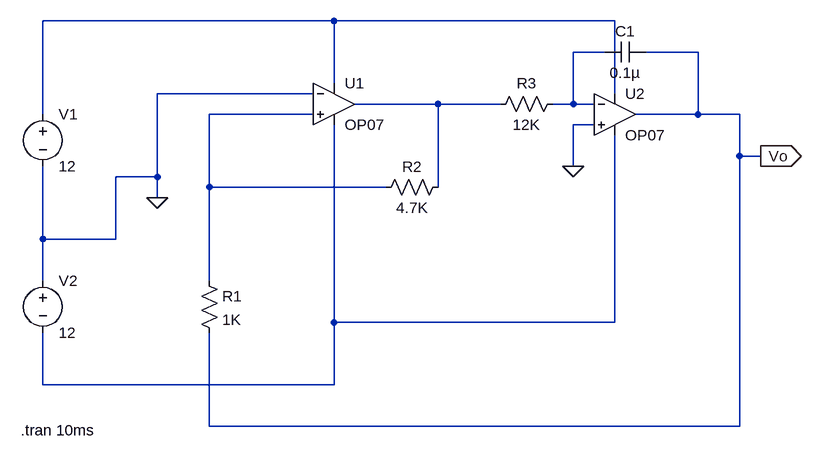
[diagram p0: schematic EC3.asc]
EC3.asc, the LTspice schematic file:
Version 4
SHEET 1 1192 744
WIRE 448 96 0 96
WIRE 880 96 448 96
WIRE 864 144 816 144
WIRE 1008 144 928 144
WIRE 448 192 448 96
WIRE 416 208 176 208
WIRE 880 208 880 96
WIRE 608 224 480 224
WIRE 704 224 608 224
WIRE 816 224 816 144
WIRE 816 224 784 224
WIRE 848 224 816 224
WIRE 0 240 0 96
WIRE 416 240 256 240
WIRE 1008 240 1008 144
WIRE 1008 240 912 240
WIRE 1072 240 1008 240
WIRE 848 256 816 256
WIRE 1072 304 1072 240
WIRE 1104 304 1072 304
WIRE 816 320 816 256
WIRE 176 336 176 208
WIRE 176 336 112 336
WIRE 256 352 256 240
WIRE 528 352 256 352
WIRE 608 352 608 224
WIRE 176 368 176 336
WIRE 0 432 0 320
WIRE 112 432 112 336
WIRE 112 432 0 432
WIRE 0 496 0 432
WIRE 256 496 256 352
WIRE 448 560 448 256
WIRE 880 560 880 272
WIRE 880 560 448 560
WIRE 0 656 0 576
WIRE 448 656 448 560
WIRE 448 656 0 656
WIRE 256 720 256 576
WIRE 1072 720 1072 304
WIRE 1072 720 256 720
FLAG 176 368 0
FLAG 816 320 0
FLAG 1104 304 Vo
IOPIN 1104 304 Out
SYMBOL voltage 0 224 R0
WINDOW 123 0 0 Left 0
WINDOW 39 0 0 Left 0
SYMATTR InstName V1
SYMATTR Value 12
SYMBOL voltage 0 480 R0
WINDOW 123 0 0 Left 0
WINDOW 39 0 0 Left 0
SYMATTR InstName V2
SYMATTR Value 12
SYMBOL OpAmps\\OP07 448 160 R0
SYMATTR InstName U1
SYMBOL res 624 336 R90
WINDOW 0 0 56 VBottom 2
WINDOW 3 32 56 VTop 2
SYMATTR InstName R2
SYMATTR Value 4.7K
SYMATTR SpiceLine tol=1 pwr=0.1
SYMBOL res 240 480 R0
SYMATTR InstName R1
SYMATTR Value 1K
SYMATTR SpiceLine tol=1 pwr=0.1
SYMBOL res 800 208 R90
WINDOW 0 0 56 VBottom 2
WINDOW 3 32 56 VTop 2
SYMATTR InstName R3
SYMATTR Value 12K
SYMATTR SpiceLine tol=1 pwr=0.1
SYMBOL OpAmps\\OP07 880 176 R0
SYMATTR InstName U2
SYMBOL cap 928 128 R90
WINDOW 0 0 32 VBottom 2
WINDOW 3 32 32 VTop 2
SYMATTR InstName C1
SYMATTR Value 0.1µ
TEXT -34 726 Left 2 !.tran 10ms

The netlist it stands for:
* EC3.asc
V1 N001 0 12
V2 0 N005 12
XU1 N004 0 N001 N005 N003 LT1001  ; OP07, pins In+ In- V+ V- OUT
R2 N003 N004 4.7K tol=1 pwr=0.1
R1 N004 Vo 1K tol=1 pwr=0.1
R3 N002 N003 12K tol=1 pwr=0.1
XU2 0 N002 N001 N005 Vo LT1001  ; OP07, pins In+ In- V+ V- OUT
C1 Vo N002 0.1µ
.tran 10ms
.lib LTC.lib
.backanno
.end